# Altium project Kite_V1.PrjPcb
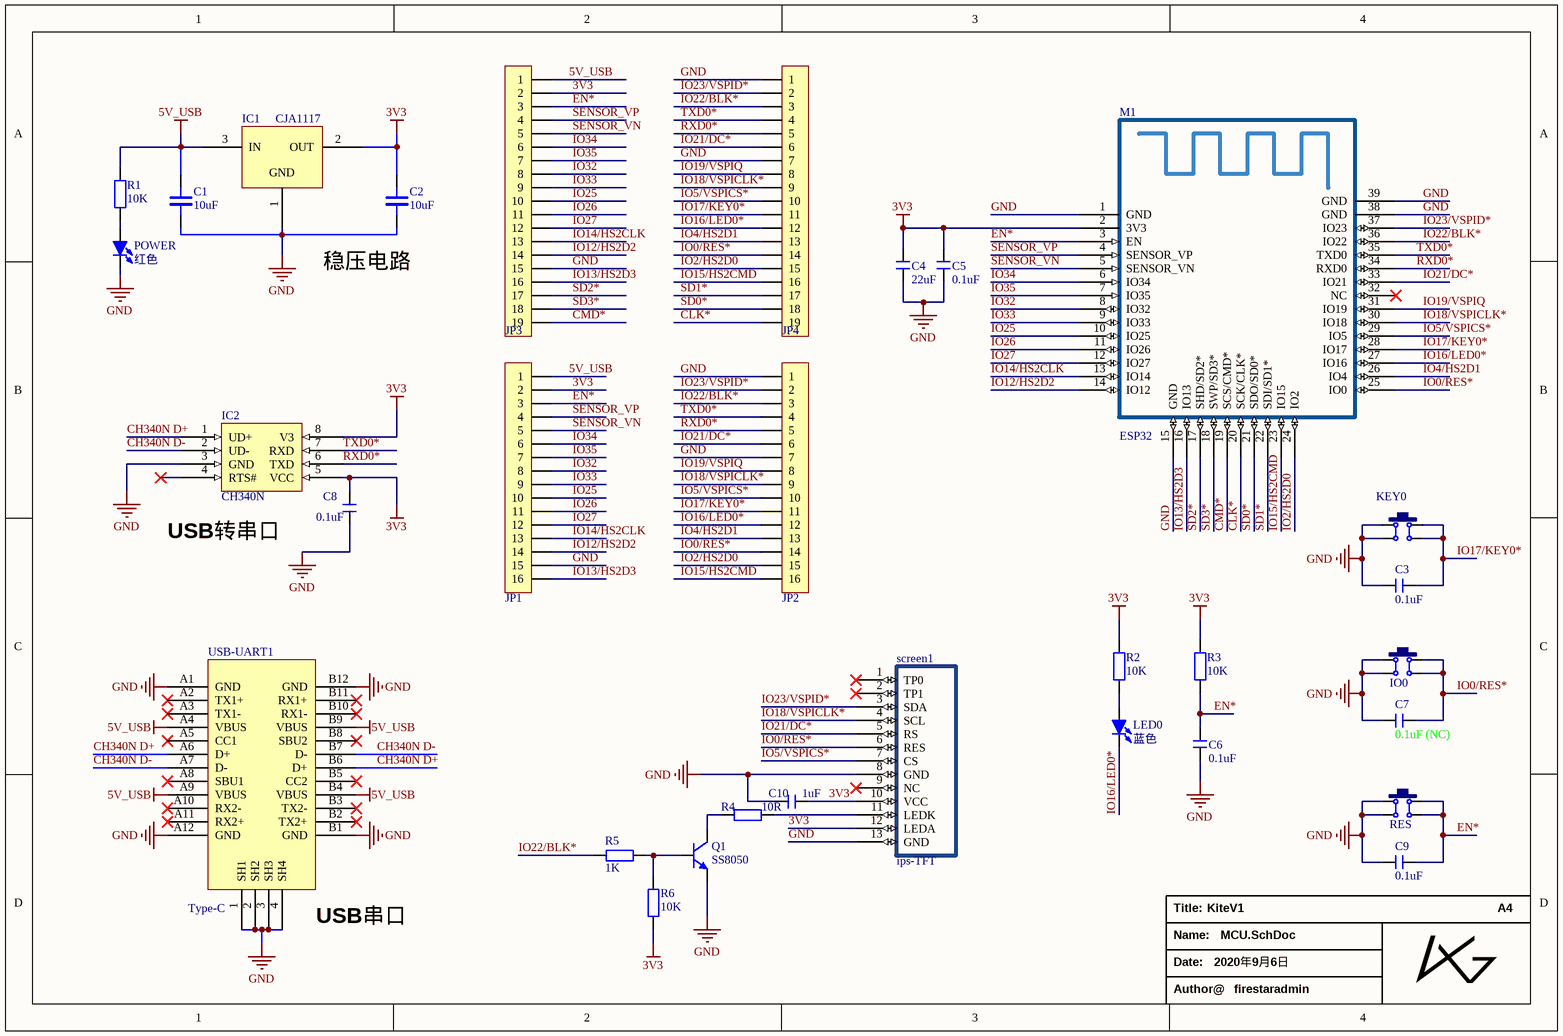
[diagram p0: MCU.SchDoc]
1 sheet, 31 parts. Net scope: global (net labels, ports and power ports of the same name join across sheets).
Board files: V1.PcbDoc, V1.02.PcbDoc

## Sheet MCU.SchDoc: KiteV1
size A4; Date: 2020年9月6日

### Parts
C1  10uF  [C 0805_L]
C2  10uF  [C 0805_L]
C3  0.1uF  [C 0603_M]
C4  22uF  [C 0603_M]
C5  0.1uF  [C 0603_M]
C6  0.1uF  [C 0603_M]
C7  0.1uF (NC)  [C 0603_M]
C8  0.1uF  [C 0603_M]
C9  0.1uF  [C 0603_M]
C10  1uF  [C 0603_M]
IC1  CJA1117  [SOT89_M]
IC2  CH340N  [SOP8_M]
IO0  key  [TSMD-3*4*2.5]  (value not drawn)
JP1  HDR-1X16  [HDR2.54-LI-16P]  (value not drawn)
JP2  HDR-1X16  [HDR2.54-LI-16P]  (value not drawn)
JP3  HDR-1X19  [HDR2.54-LI-19P]  (value not drawn)
JP4  HDR-1X19  [HDR2.54-LI-19P]  (value not drawn)
KEY0  key  [TSMD-3*4*2.5]  (value not drawn)
LED0  蓝色  [LED 0603R]
M1  ESP32  [ESP32-WROOM-32]
POWER  红色  [LED 0603R]
Q1  SS8050  [SOT23-3N]
R1  10K  [R 0603_M]
R2  10K  [R 0603_M]
R3  10K  [R 0603_M]
R4  10R  [R 0603_M]
R5  1K  [R 0603_M]
R6  10K  [R 0603_M]
RES  key  [TSMD-3*4*2.5]  (value not drawn)
screen1  ips-TFT  [ips-TFT-0.96寸-st7735-SPI]
USB-UART1  Type-C  [Type-C]

### Nets
3V3: C2.1 C4.1 C5.1 C8.2 C10.2 IC1.2(OUT) IC2.5(VCC) IC2.8(V3) JP1.2 JP3.2 M1.2(3V3) R2.2 R3.2 R6.1 screen1.10(VCC) screen1.12(LEDA)
5V_USB: C1.1 IC1.3(IN) JP1.1 JP3.1 R1.2 USB-UART1.A4(VBUS) USB-UART1.A9(VBUS) USB-UART1.B4(VBUS) USB-UART1.B9(VBUS)
GND: C1.2 C2.2 C3.1 C4.2 C5.2 C6.2 C7.1 C8.1 C9.1 C10.1 IC1.1(GND) IC2.3(GND) IO0.1 IO0.2 JP1.15 JP2.1 JP2.7 JP3.15 JP4.1 JP4.7 KEY0.1 KEY0.2 M1.1(GND) M1.15(GND) M1.38(GND) M1.39(GND) POWER.2(K) Q1.2(E) RES.1 RES.2 screen1.8(GND) screen1.13(GND) USB-UART1.1(SH1) USB-UART1.2(SH2) USB-UART1.3(SH3) USB-UART1.4(SH4) USB-UART1.A1(GND) USB-UART1.A12(GND) USB-UART1.B1(GND) USB-UART1.B12(GND)
CH340N D+: IC2.1(UD+) USB-UART1.A6(D+) USB-UART1.B6(D+)
CH340N D-: IC2.2(UD-) USB-UART1.A7(D-) USB-UART1.B7(D-)
CLK*: JP4.19 M1.20(SCK/CLK*)
CMD*: JP3.19 M1.19(SCS/CMD*)
EN*: C6.1 C9.2 JP1.3 JP3.3 M1.3(EN) R3.1 RES.3 RES.4
IO0/RES*: C7.2 IO0.3 IO0.4 JP2.14 JP4.14 M1.25(IO0) screen1.6(RES)
IO2/HS2D0: JP2.15 JP4.15 M1.24(IO2)
IO4/HS2D1: JP2.13 JP4.13 M1.26(IO4)
IO5/VSPICS*: JP2.10 JP4.10 M1.29(IO5) screen1.7(CS)
IO12/HS2D2: JP1.14 JP3.14 M1.14(IO12)
IO13/HS2D3: JP1.16 JP3.16 M1.16(IO13)
IO14/HS2CLK: JP1.13 JP3.13 M1.13(IO14)
IO15/HS2CMD: JP2.16 JP4.16 M1.23(IO15)
IO16/LED0*: JP2.12 JP4.12 LED0.2(K) M1.27(IO16)
IO17/KEY0*: C3.2 JP2.11 JP4.11 KEY0.3 KEY0.4 M1.28(IO17)
IO18/VSPICLK*: JP2.9 JP4.9 M1.30(IO18) screen1.4(SCL)
IO19/VSPIQ: JP2.8 JP4.8 M1.31(IO19)
IO21/DC*: JP2.6 JP4.6 M1.33(IO21) screen1.5(RS)
IO22/BLK*: JP2.3 JP4.3 M1.36(IO22) R5.2
IO23/VSPID*: JP2.2 JP4.2 M1.37(IO23) screen1.3(SDA)
IO25: JP1.10 JP3.10 M1.10(IO25)
IO26: JP1.11 JP3.11 M1.11(IO26)
IO27: JP1.12 JP3.12 M1.12(IO27)
IO32: JP1.8 JP3.8 M1.8(IO32)
IO33: JP1.9 JP3.9 M1.9(IO33)
IO34: JP1.6 JP3.6 M1.6(IO34)
IO35: JP1.7 JP3.7 M1.7(IO35)
RXD0*: IC2.6(TXD) JP2.5 JP4.5 M1.34(RXD0)
SD0*: JP4.18 M1.21(SDO/SD0*)
SD1*: JP4.17 M1.22(SDI/SD1*)
SD2*: JP3.17 M1.17(SHD/SD2*)
SD3*: JP3.18 M1.18(SWP/SD3*)
SENSOR_VN: JP1.5 JP3.5 M1.5(SENSOR_VN)
SENSOR_VP: JP1.4 JP3.4 M1.4(SENSOR_VP)
TXD0*: IC2.7(RXD) JP2.4 JP4.4 M1.35(TXD0)
NetLED0_1: LED0.1(A) R2.1
NetPOWER_1: POWER.1(A) R1.1
NetQ1_1: Q1.1(B) R5.1 R6.2
NetQ1_3: Q1.3(C) R4.2
NetR4_1: R4.1 screen1.11(LEDK)

Not connected (* = marked no-connect by the designer): IC2 4(RTS#)*; M1 32(NC)*; screen1 1(TP0)* 2(TP1)* 9(NC)*; USB-UART1 A2(TX1+)* A3(TX1-)* A5(CC1)* A8(SBU1)* A10(RX2-)* A11(RX2+)* B2(TX2+)* B3(TX2-)* B5(CC2)* B8(SBU2)* B10(RX1-)* B11(RX1+)*

### Notes on the sheet
- 稳压电路
- (near IC2) USB转串口
- (near USB-UART1) USB串口
- Title:
- A4
- Name:
- Date:
- Author@
- firestaradmin

### Library data of the parts
C1 C2 = CAP: Capacitor
C3-C10 = C: 无极性贴片电容; 版权归属: 源创客; BOM名称: 无极性贴片电容; 学习资源: www.ooocke.com
IC2 = CH340N: USB 转串口芯片 CH330/CH340N
IO0 KEY0 RES = TS-3x4x2.5mm-4pin: TS-3x4x2.5mm-4pin 轻触按键
JP1 JP2 = Header 16: 16P接插件; 版权归属: 源创客; BOM名称: 16P接插件; 学习资源: www.ooocke.com
JP3 JP4 = Header 19: 19P接插件; 版权归属: 源创客; BOM名称: 19P接插件; 学习资源: www.ooocke.com
LED0 POWER = LED-SMD: 贴片LED; 版权归属: 源创客; BOM名称: 贴片LED; 学习资源: www.ooocke.com
M1 = ESP32-WROOM-32: ESP32-WROOM-32 WIFI 蓝牙模组
Q1 = 8050-SMD: 高频放大-NPN型; 版权归属: 源创客; 属性: 40V 1.5A 1W 100MHZ; BOM名称: 高频放大-NPN型; 学习资源: www.ooocke.com
R1-R6 = R: 贴片电阻; 版权归属: 源创客; BOM名称: 贴片电阻; 学习资源: www.ooocke.com
screen1 = ips-TFT-0.96寸-st7735-SPI: 中景园ips 0.96寸TFT显示屏ips液晶屏0.96寸st7735 ips显示屏 13pins